# Altium schematic sheet Pressure-Sensor.SchDoc
size A; SheetNumber: 11; SheetTotal: 17
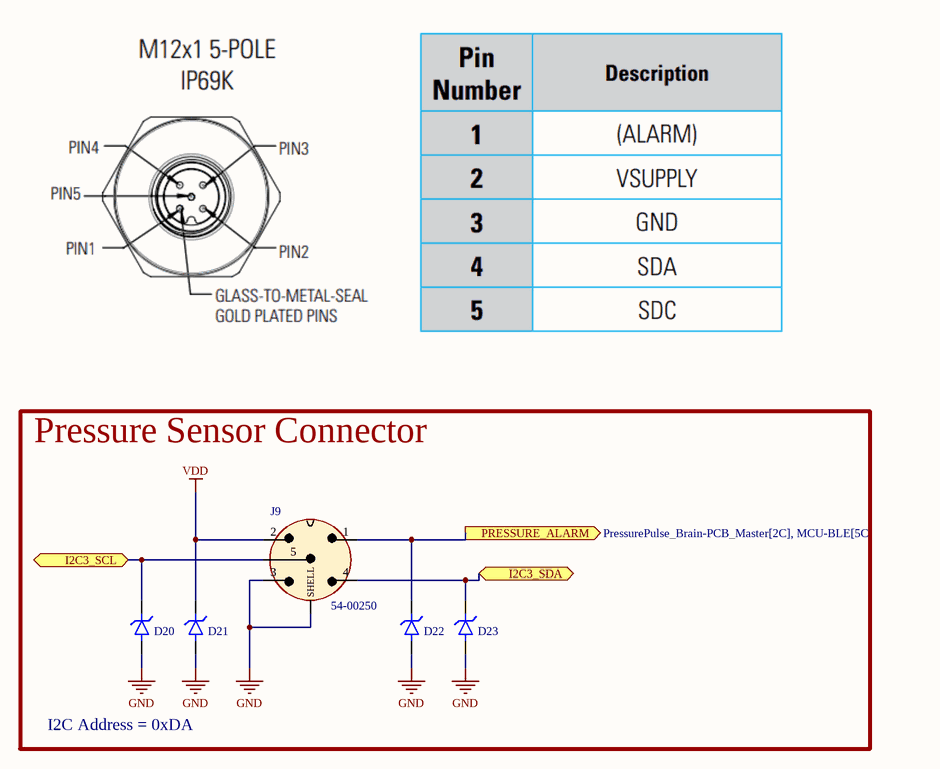
[diagram p0: Pressure-Sensor.SchDoc]

## Parts
D20  RCLAMP0521P.TCT  [BDFN2C051V40]  (value not drawn)
D21  RCLAMP0521P.TCT  [BDFN2C051V40]  (value not drawn)
D22  RCLAMP0521P.TCT  [BDFN2C051V40]  (value not drawn)
D23  RCLAMP0521P.TCT  [BDFN2C051V40]  (value not drawn)
J9  54-00250  [TENSILITY_54-00250]

## Ports
I2C3_SCL (bidir, see PressurePulse_Brain-PCB_Master[2C], Flow-Sensor[2C], Fuel-Gauge[4B], Gyroscope[1C], MCU-BLE[2D]), I2C3_SDA (bidir, see PressurePulse_Brain-PCB_Master[2C], Flow-Sensor[3C], Fuel-Gauge[4B], Gyroscope[1C], MCU-BLE[2D]), PRESSURE_ALARM (out, see PressurePulse_Brain-PCB_Master[2C], MCU-BLE[5C])

## Nets
GND: D20.A D21.A D22.A D23.A J9.3 J9.SHELL
VDD: D21.K J9.2
I2C3_SCL: D20.K J9.5 ; port I2C3_SCL
I2C3_SDA: D23.K J9.4 ; port I2C3_SDA
PRESSURE_ALARM: D22.K J9.1 ; port PRESSURE_ALARM

## Notes on the sheet
- Pressure Sensor Connector
- I2C Address = 0xDA

## Library data of the parts
D20-D23 = TVS DIODE: 25V Clamp 4A (8/20µs) Ipp Tvs Diode Surface Mount SLP1006P2; MFR: BORN; Type: SMD; Value: BDFN2C051V40; MFR PN: BDFN2C051V40; JLCPCB PN: C152023
J9 = M12 5POS TH RA: CONN PLUG MALE 5POS GOLD SOLDER; MFR: Tensility International Corp; Value: DNS; MFR PN: 54-00250